# Altium schematic sheet Shutdown.SchDoc
size A4; SheetNumber: 3; SheetTotal: 5
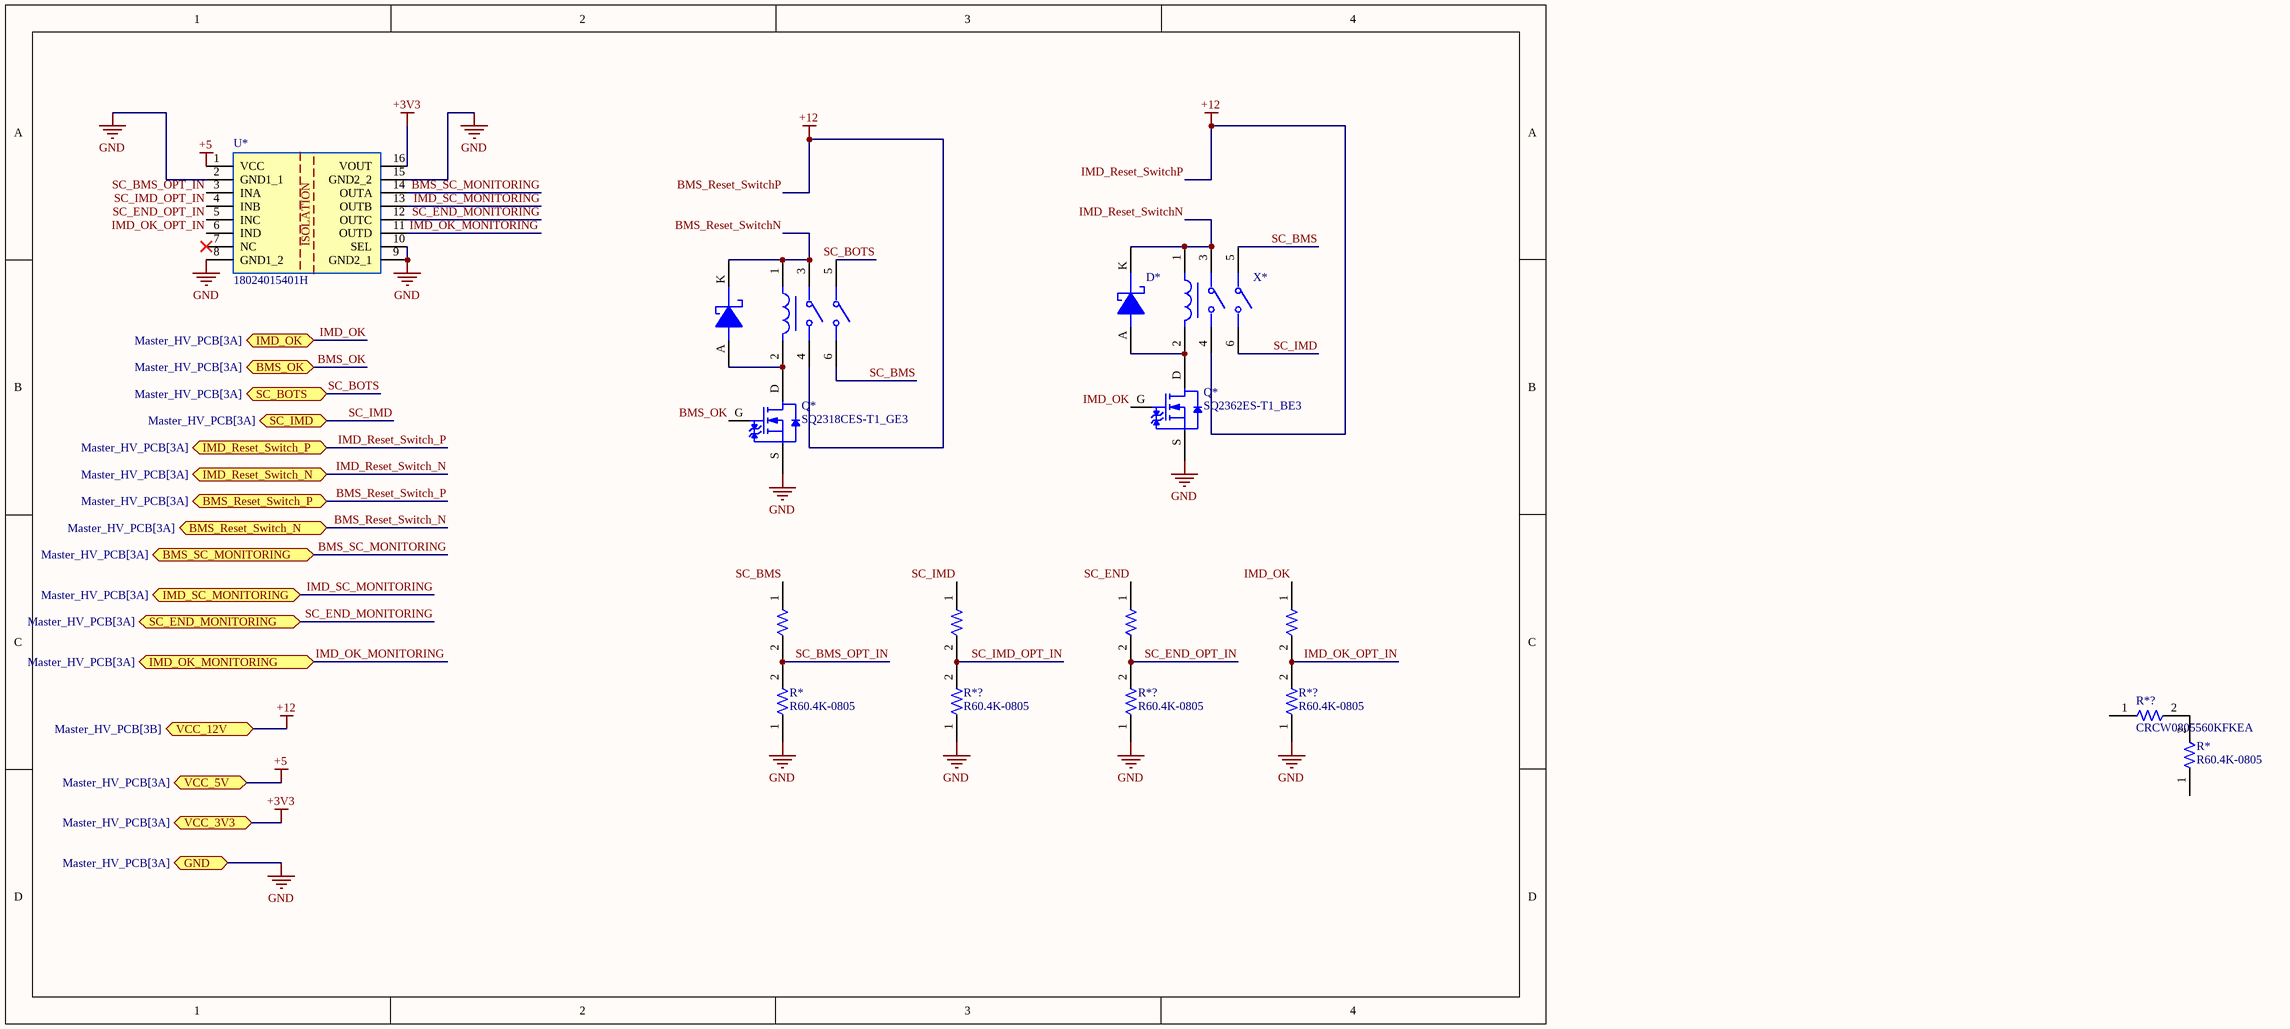
[diagram p0: Shutdown.SchDoc]

## Parts
(Parts that share a designator on the sheet are numbered #1, #2 ... from top to bottom, then left to right.)
D*#1  DSC-0.5/30-SOD123  [DSC-SOD123]  (value not drawn)
D*#2  DSC-0.5/30-SOD123  [DSC-SOD123]  (value not drawn)
Q*#1  SQ2362ES-T1_BE3  [SOT95P245X110-3N]
Q*#2  SQ2318CES-T1_GE3  [SOT95P245X110-3N]
R*#1  CRCW0805560KFKEA  [0805]  (value not drawn)
R*#2  R60.4K-0805  [FP-CR0805-IPC_A]
R*#3  R60.4K-0805  [FP-CR0805-IPC_A]
R*?#1  CRCW0805560KFKEA  [0805]  (value not drawn)
R*?#2  CRCW0805560KFKEA  [0805]  (value not drawn)
R*?#3  CRCW0805560KFKEA  [0805]  (value not drawn)
R*?#4  CRCW0805560KFKEA  [0805]
R*?#5  R60.4K-0805  [FP-CR0805-IPC_A]
R*?#6  R60.4K-0805  [FP-CR0805-IPC_A]
R*?#7  R60.4K-0805  [FP-CR0805-IPC_A]
U*  18024015401H  [18024015401H]
X*  RTE44012F  [RTE44012F-Footprint-1]  (value not drawn)
X*?  RTE44012F  [RTE44012F-Footprint-1]  (value not drawn)

## Ports
BMS_OK (bidir, see Master_HV_PCB[3A]), BMS_Reset_Switch_N (bidir, see Master_HV_PCB[3A]), BMS_Reset_Switch_P (bidir, see Master_HV_PCB[3A]), BMS_SC_MONITORING (bidir, see Master_HV_PCB[3A]), GND (bidir, see Master_HV_PCB[3A]), IMD_OK (bidir, see Master_HV_PCB[3A]), IMD_OK_MONITORING (bidir, see Master_HV_PCB[3A]), IMD_Reset_Switch_N (bidir, see Master_HV_PCB[3A]), IMD_Reset_Switch_P (bidir, see Master_HV_PCB[3A]), IMD_SC_MONITORING (bidir, see Master_HV_PCB[3A]), SC_BOTS (bidir, see Master_HV_PCB[3A]), SC_END_MONITORING (bidir, see Master_HV_PCB[3A]), SC_IMD (bidir, see Master_HV_PCB[3A]), VCC_3V3 (bidir, see Master_HV_PCB[3A]), VCC_5V (bidir, see Master_HV_PCB[3A]), VCC_12V (bidir, see Master_HV_PCB[3B])

## Nets
+3V3: U*.16(VOUT) ; port VCC_3V3
+5: U*.1(VCC) ; port VCC_5V
BMS_Reset_SwitchP: X*.4 X*?.4 ; port VCC_12V  [also labelled +12, IMD_Reset_SwitchP]
GND: Q*#1.S Q*#2.S R*#2.1 R*?#5.1 R*?#6.1 R*?#7.1 U*.2(GND1_1) U*.8(GND1_2) U*.9(GND2_1) U*.10(SEL) U*.15(GND2_2) ; port GND
BMS_OK: Q*#2.G ; port BMS_OK
BMS_Reset_Switch_N: port BMS_Reset_Switch_N
BMS_Reset_Switch_P: port BMS_Reset_Switch_P
BMS_Reset_SwitchN: D*#2.K X*?.1 X*?.3
BMS_SC_MONITORING: U*.14(OUTA) ; port BMS_SC_MONITORING
IMD_OK: Q*#1.G R*?#3.1 ; port IMD_OK
IMD_OK_MONITORING: U*.11(OUTD) ; port IMD_OK_MONITORING
IMD_OK_OPT_IN: R*?#3.2 R*?#7.2 U*.6(IND)
IMD_Reset_Switch_N: port IMD_Reset_Switch_N
IMD_Reset_Switch_P: port IMD_Reset_Switch_P
IMD_Reset_SwitchN: D*#1.K X*.1 X*.3
IMD_SC_MONITORING: U*.13(OUTB) ; port IMD_SC_MONITORING
SC_BMS: R*#1.1 X*.5 X*?.6
SC_BMS_OPT_IN: R*#1.2 R*#2.2 U*.3(INA)
SC_BOTS: X*?.5 ; port SC_BOTS
SC_END: R*?#2.1
SC_END_MONITORING: U*.12(OUTC) ; port SC_END_MONITORING
SC_END_OPT_IN: R*?#2.2 R*?#6.2 U*.5(INC)
SC_IMD: R*?#1.1 X*.6 ; port SC_IMD
SC_IMD_OPT_IN: R*?#1.2 R*?#5.2 U*.4(INB)
NetD*#1_A: D*#1.A Q*#1.D X*.2
NetD*#2_A: D*#2.A Q*#2.D X*?.2
NetR*#3_2: R*#3.2 R*?#4.2

Not connected (* = marked no-connect by the designer): R*#3 1; R*?#4 1; U* 7(NC)*

## Notes on the sheet
- (in symbol CMP-00200-1) ISOLATION

## Library data of the parts
D*#1 D*#2 = CMP-00165-1: VR=30V IF=500mA 30pF P=410mW; Max Reverse Leakage Current: 130uA; .Creator: GP; Max Reverse Voltage (DC): 30V; Element Configuration: Single; Average Rectified Current: 500mA; Peak Non-Repetitive Surge Current: 5.5A; Polarity: Standard; Forward Voltage: 430mV; ComponentLink10Description: https://datasheet.ciiva.com/910/mbr0530-910518.pdf?src-supplier=Digi-Key; ComponentLink1Description: Datasheet; Category: Diode; ComponentLink3Description: https://datasheet.ciiva.com/30479/0900766b810e2512-30479401.pdf?src-supplier=RSComponents; ComponentLink5Description: https://datasheet.ciiva.com/910/mbr0530-910516.pdf?src-supplier=Digi-Key; Stock 1: 9; Weight: 0.03g; Source: Filter components.SchLib; ComponentLink2Description: Where buy it; Series: -; Mount: Surface Mount; Max Repetitive Reverse Voltage (Vrrm): 30V; Pricing 1: 1=0,34400, 10=0,23900, 100=0,12200, 500=0,10000 (USD); Design Item ID: DSC-0.5/30-SOD123; ComponentLink8Description: https://datasheet.ciiva.com/17318/mbr0530-17318568.pdf?src-supplier=Future+Electronics; Current Rating: 500mA; ComponentLink1URL: *; Length: 2.7mm; Max Reverse Current: 130uA; ComponentLink7URL: https://datasheet.ciiva.com/8300/mbr0530-8300905.pdf?src-supplier=Avnet; ComponentLink9URL: https://datasheet.ciiva.com/15144/getdatasheetpartid-86760-15144598.pdf?src-supplier=Verical; Radiation Hardening: No; Height: 1.03mm; ComponentLink4Description: https://datasheet.ciiva.com/34301/974753-34301826.pdf?src-supplier=Jameco; ComponentLink7Description: https://datasheet.ciiva.com/8300/mbr0530-8300905.pdf?src-supplier=Avnet; Package Quantity: 1; Forward Current: 500mA; ComponentLink5URL: https://datasheet.ciiva.com/910/mbr0530-910516.pdf?src-supplier=Digi-Key; Max Surge Current: 5.5A; Lead Free: Lead Free; ComponentLink2URL: *; Max Forward Surge Current (Ifsm): 5.5A; Output Current: 500mA; Voltage Rating (DC): 30V; Contact Plating: Tin,Matte; RoHS Compliant: Yes; REACH SVHC: No SVHC; ComponentLink10URL: https://datasheet.ciiva.com/910/mbr0530-910518.pdf?src-supplier=Digi-Key; ComponentLink4URL: https://datasheet.ciiva.com/34301/974753-34301826.pdf?src-supplier=Jameco; ComponentLink6URL: https://datasheet.ciiva.com/25931/mbr0530-25931989.pdf?src-supplier=Avnet+Europe; ComponentLink6Description: https://datasheet.ciiva.com/25931/mbr0530-25931989.pdf?src-supplier=Avnet+Europe; Width: 1.6mm; ComponentLink3URL: https://datasheet.ciiva.com/30479/0900766b810e2512-30479401.pdf?src-supplier=RSComponents; ComponentLink9Description: https://datasheet.ciiva.com/15144/getdatasheetpartid-86760-15144598.pdf?src-supplier=Verical; ComponentLink8URL: https://datasheet.ciiva.com/17318/mbr0530-17318568.pdf?src-supplier=Future+Electronics
Q*#1 = CMP-013-00001-1: Small Signal Field-Effect Transistor; RoHS Compliant: Yes
Q*#2 = CMP-013-00002-1: Mosfet, N-channel, 40V, 7A, SOT-23 Rohs Compliant: Yes
R*#1 R*?#1-R*?#4 = CMP-009-00008-1: Fixed Resistor, Metal Glaze/thick Film, 0.125W, 560000ohm, 150V, 1% +/-Tol, 100ppm/Cel, Surface Mount, 0805; Value: 560k; Power: 125mW; Case/Package: 0805; Tolerance: 1%; Pins: 2; Max Operating Temperature: 155°C; Min Operating Temperature: -55°C; RoHS Compliant: Yes; Mounting Technology: Surface Mount
R*#2 R*#3 R*?#5-R*?#7 = CMP-009-00001-1: Fixed Resistor, Metal Glaze/thick Film, 0.125W, 60400ohm, 150V, 1% +/-Tol, 100ppm/Cel, Surface Mount, 0805; Value: 60.4k; Power: 125mW; RoHS Compliant: Yes; Mounting Technology: Surface Mount; Tolerance: 1%; Max Operating Temperature: 155°C; Case/Package: 0805; Min Operating Temperature: -55°C; Pins: 2
U* = CMP-00200-1: Digital Isolator, 4CH, 125DEG C, WSOIC16 Rohs Compliant: Yes
X* X*? = CMP-00199-1: Power/Signal Relay, 2 Form A, DPST, Momentary, 0.033A (Coil), 12VDC (Coil), 400mW (Coil), 8A (Contact), 30VDC (Contact), DC Input, Random, AC/DC Output, Through Hole-Straight Mount; Sealing: IMMERSION CLEANABLE CASE; Electrical Life: 30000Cycles; Release Time: 6ms; Operate Time: 15ms; Body Length or Diameter: 29mm; Contact AC Max Power Rating R Load: 2000VA@400VAC; Coil Voltage-Nom: 12V; Body Height: 15.7mm; Dielectric Strength Between Open Contacts: 1000Vrms; PCB Hole Count: 8; Reference Standard: UL; Coil Current(DC)-Max: 33mA; Contact Voltage(AC)-Max: 250V; Dielectric Strength Between Coil and Contacts: 5000Vrms; Coil Resistance: 360R; Coil Operate Voltage(DC): 8.4V; Body Breadth: 12.7inch; Contact DC Max Rating R Load: 8A@30VDC; Contact Voltage(DC)-Max: 30V; Contact AC Max Rating R Load: 8A@250VAC; Coil Release Voltage(DC): 1.2V; End Contact Material: Silver; Relay Form: 2 FORM A; Input Switching Control Type: Random; Min Operating Temperature: -40°C; Termination: Solder; Contact/Output Supply Type: AC/DC; Max Operating Temperature: 85°C; Mounting Technology: Through Hole; Contact Current(AC)-Max: 8A; Coil Power: 400mW; Terminal Length: 0.0036inch; Weight: 13g; Coil/Input Supply Type: DC; RoHS Compliant: Yes; Pins: 8; Relay Function: DPST; Packaging: Box; Contact Current(DC)-Max: 8A; Relay Action: MOMENTARY; Coil Voltage(DC)-Max: 12V; Relay Type: POWER/SIGNAL RELAY; Reach SVHC Compliant: Yes